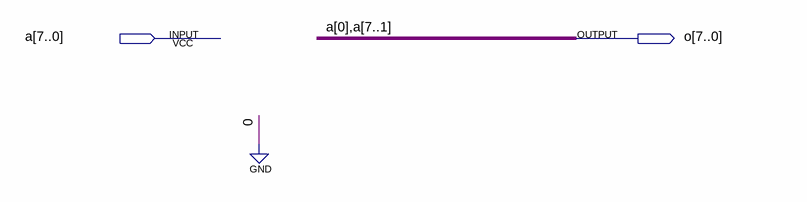
[diagram p0: schematic sheet]
// Quartus schematic AR_SR8.bdf as structural Verilog: 0 symbols, 2 pins
module AR_SR8 (
  input  [7:0] a,
  output [7:0] o
);


  assign o = {a[0], a[7:1]};
endmodule
